# EAGLE schematic esr_meter_arduino (EAGLE 7.2.0)
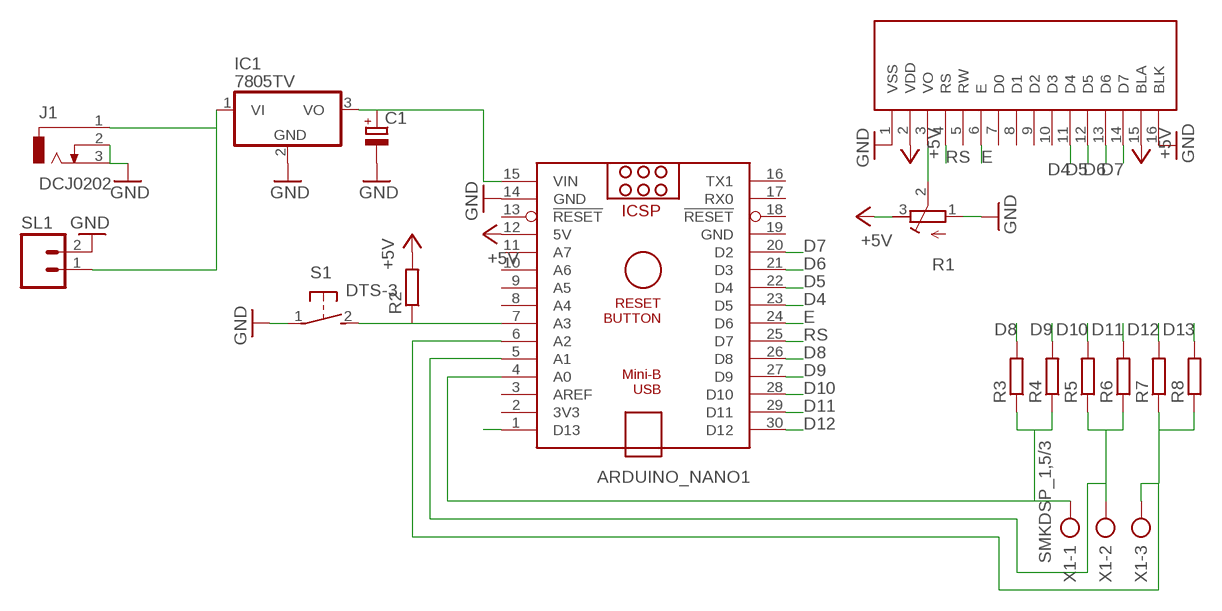
[diagram p0: schematic, sheet 1]

## Parts
ARDUINO_NANO1  ARDUINO_NANO  [ARDUINO_NANO]
C1  CPOL-EUE2.5-5  [E2,5-5]
IC1  7805TV  [TO220V]
J1  DCJ0202  [DCJ0202]
R1  R-TRIMM3339P  [RTRIM3339P]
R2  R-EU_0207/10  [0207/10]
R3  R-EU_0207/10  [0207/10]
R4  R-EU_0207/10  [0207/10]
R5  R-EU_0207/10  [0207/10]
R6  R-EU_0207/10  [0207/10]
R7  R-EU_0207/10  [0207/10]
R8  R-EU_0207/10  [0207/10]
S1  DTS-3  [DTS-3]
SL1  M02  [02P]
U$1  2X16LCDTOP  [2X16LCDTOP]
X1  SMKDSP_1,5/3  [SMKDSP_1,5/3]

## Nets
+5V: ARDUINO_NANO1.12(5V) R1.3(E) R2.2 U$1.2(VDD) U$1.15(BLA)
D4: ARDUINO_NANO1.23(D5) U$1.11(D4)
D5: ARDUINO_NANO1.22(D4) U$1.12(D5)
D6: ARDUINO_NANO1.21(D3) U$1.13(D6)
D7: ARDUINO_NANO1.20(D2) U$1.14(D7)
D8: ARDUINO_NANO1.26(D8) R3.2
D9: ARDUINO_NANO1.27(D9) R4.2
D10: ARDUINO_NANO1.28(D10) R5.2
D11: ARDUINO_NANO1.29(D11) R6.2
D12: ARDUINO_NANO1.30(D12) R7.2
D13: ARDUINO_NANO1.1(D13) R8.2
E: ARDUINO_NANO1.24(D6) U$1.6(E)
GND: ARDUINO_NANO1.14(GND) C1.- IC1.2(GND) J1.2 J1.3 R1.1(A) S1.1 SL1.2 U$1.1(VSS) U$1.16(BLK)
N$2: ARDUINO_NANO1.15(VIN) C1.+ IC1.3(VO)
N$3: R1.2(S) U$1.3(VO)
N$4: ARDUINO_NANO1.7(A3) R2.1 S1.2
N$7: ARDUINO_NANO1.4(A0) R3.1 R4.1 X1.1
N$8: ARDUINO_NANO1.5(A1) R5.1 R6.1 X1.2
N$9: ARDUINO_NANO1.6(A2) R7.1 R8.1 X1.3
N$13: IC1.1(VI) J1.1 SL1.1
RS: ARDUINO_NANO1.25(D7) U$1.4(RS)
Unconnected: ARDUINO_NANO1.2(3V3) ARDUINO_NANO1.3(AREF) ARDUINO_NANO1.8(A4) ARDUINO_NANO1.9(A5) ARDUINO_NANO1.10(A6) ARDUINO_NANO1.11(A7) ARDUINO_NANO1.13(!RESET) ARDUINO_NANO1.16(TX1) ARDUINO_NANO1.17(RX0) ARDUINO_NANO1.18(!RESET) U$1.5(RW) U$1.7(D0) U$1.8(D1) U$1.9(D2) U$1.10(D3)

## Power pins joined to a net without a drawn wire
GND: ARDUINO_NANO1.19(GND)

## Library data of the parts
ARDUINO_NANO1 = ArduinoNanoV30:ARDUINO_NANO: Arduino Nano V3.0 Overview: The Arduino Nano is a small, complete, and breadboard-friendly board based on the ATmega328 (Arduino Nano 3.x) or ATmega168 (Arduino Nano 2.x). It has more or less the same functionality of the Arduino Duemilanove, but in a different package. It lacks only a DC power jack, and works with a Mini-B USB cable instead of a standard one. The Nano was designed and is being produced by Gravitech. Specifications: Microcontroller Atmel ATmega168 or ATmega328 Operating Voltage (logic level) 5 V Input Voltage (recommended) 7-12 V Input Voltage (limits) 6-20 V Digital I/O Pins 14 (of which 6 provide PWM output) Analog Input Pins 8 DC Current per I/O Pin 40 mA Flash Memory 16 KB (ATmega168) or 32 KB (ATmega328) of which 2 KB used by bootloader SRAM 1 KB (ATmega168) or 2 KB (ATmega328) EEPROM 512 bytes (ATmega168) or 1 KB (ATmega328) Clock Speed 16 MHz Dimensions 0.73" x 1.70" Length 45 mm Width 18 mm Weigth 5 g Power: The Arduino Nano can be powered via the Mini-B USB connection, 6-20V unregulated external power supply (pin 30), or 5V regulated external power supply (pin 27). The power source is automatically selected to the highest voltage source. Memory: The ATmega168 has 16 KB of flash memory for storing code (of which 2 KB is used for the bootloader); the ATmega328 has 32 KB, (also with 2 KB used for the bootloader). The ATmega168 has 1 KB of SRAM and 512 bytes of EEPROM (which can be read and written with the EEPROM library); the ATmega328 has 2 KB of SRAM and 1 KB of EEPROM. Input and Output: Each of the 14 digital pins on the Nano can be used as an input or output, using pinMode(), digitalWrite(), and digitalRead() functions. They operate at 5 volts. Each pin can provide or receive a maximum of 40 mA and has an internal pull-up resistor (disconnected by default) of 20-50 kOhms. In addition, some pins have specialized functions. Visit Arduino - ArduinoBoardNano <https://www.arduino.cc/en/Main/ArduinoBoardNano>
C1 = resistor:CPOL-EU: POLARIZED CAPACITOR, European symbol
IC1 = linear:78*: Positive VOLTAGE REGULATOR Source: http://cache.national.com/ds/LM/LM78L05.pdf http://www.fairchildsemi.com/ds/LM/LM7805.pdf
J1 = con-jack:DCJ0202: DC POWER JACK Source: DCJ0202.pdf; OC_FARNELL: unknown; OC_NEWARK: unknown
R1 = resistor:R-TRIMM: Trimm resistor
R2-R8 = resistor:R-EU_: RESISTOR, European symbol
S1 = switch-tact:DTS-3
SL1 = con-amp-quick:M02: AMP QUICK CONNECTOR; OC_FARNELL: unknown; OC_NEWARK: unknown
U$1 = lcd_modules_ece:2X16LCDTOP
X1 = con-phoenix-smkdsp:SMKDSP_1,5/3: Printklemme, Nennstrom: 17,5 A, Bemessungsspannung: 250 V, Raster: 5,0 mm Source: http://eshop.phoenixcontact.de .. 1733415.pdf; MF: FARNELL; MPN: 1733583; OC_FARNELL: 3041256; OC_NEWARK: 71C4130